# EasyEDA Pro project 25集创赛海云捷讯杯.epro, board PCB4_1
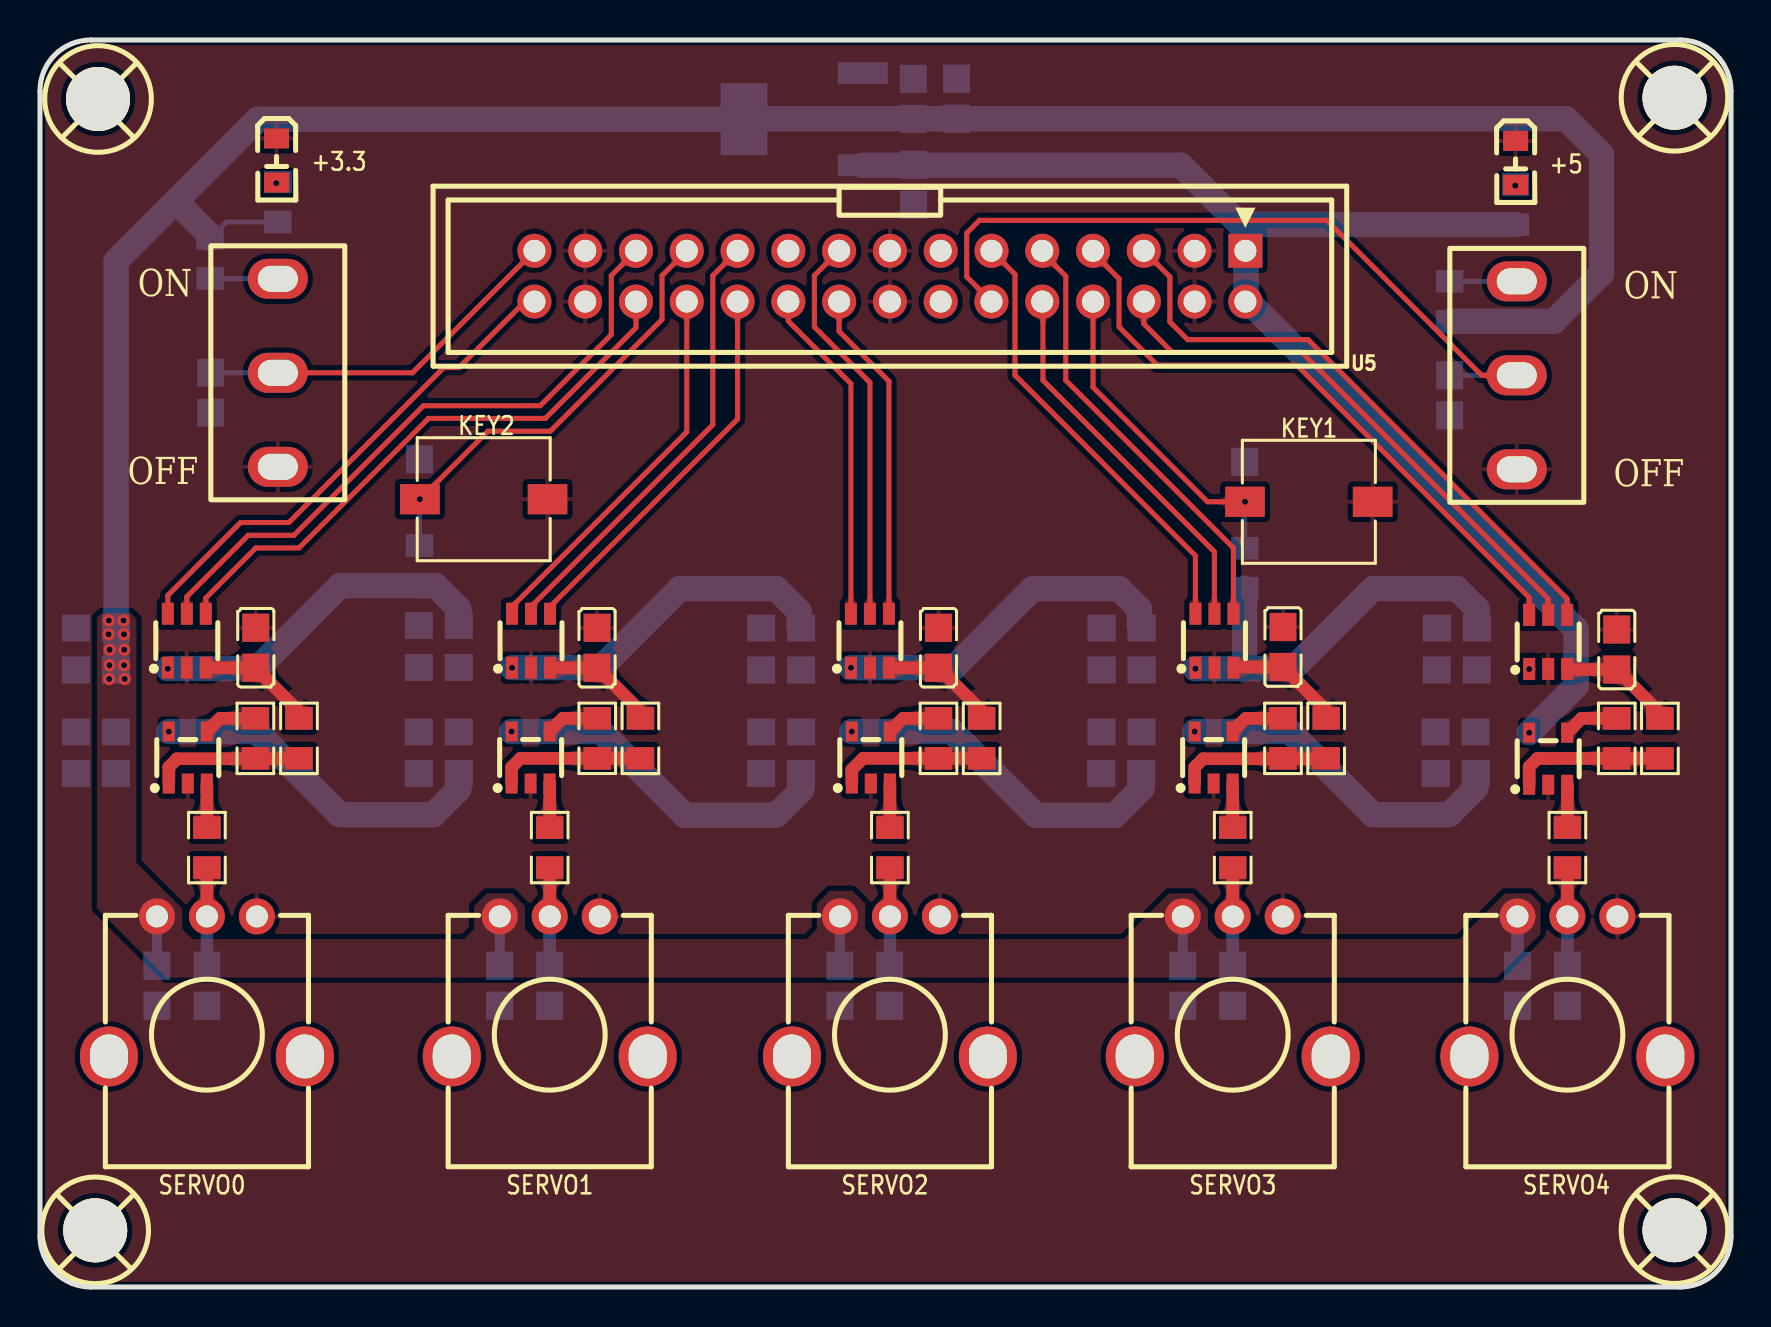
[diagram p16: board, top side]
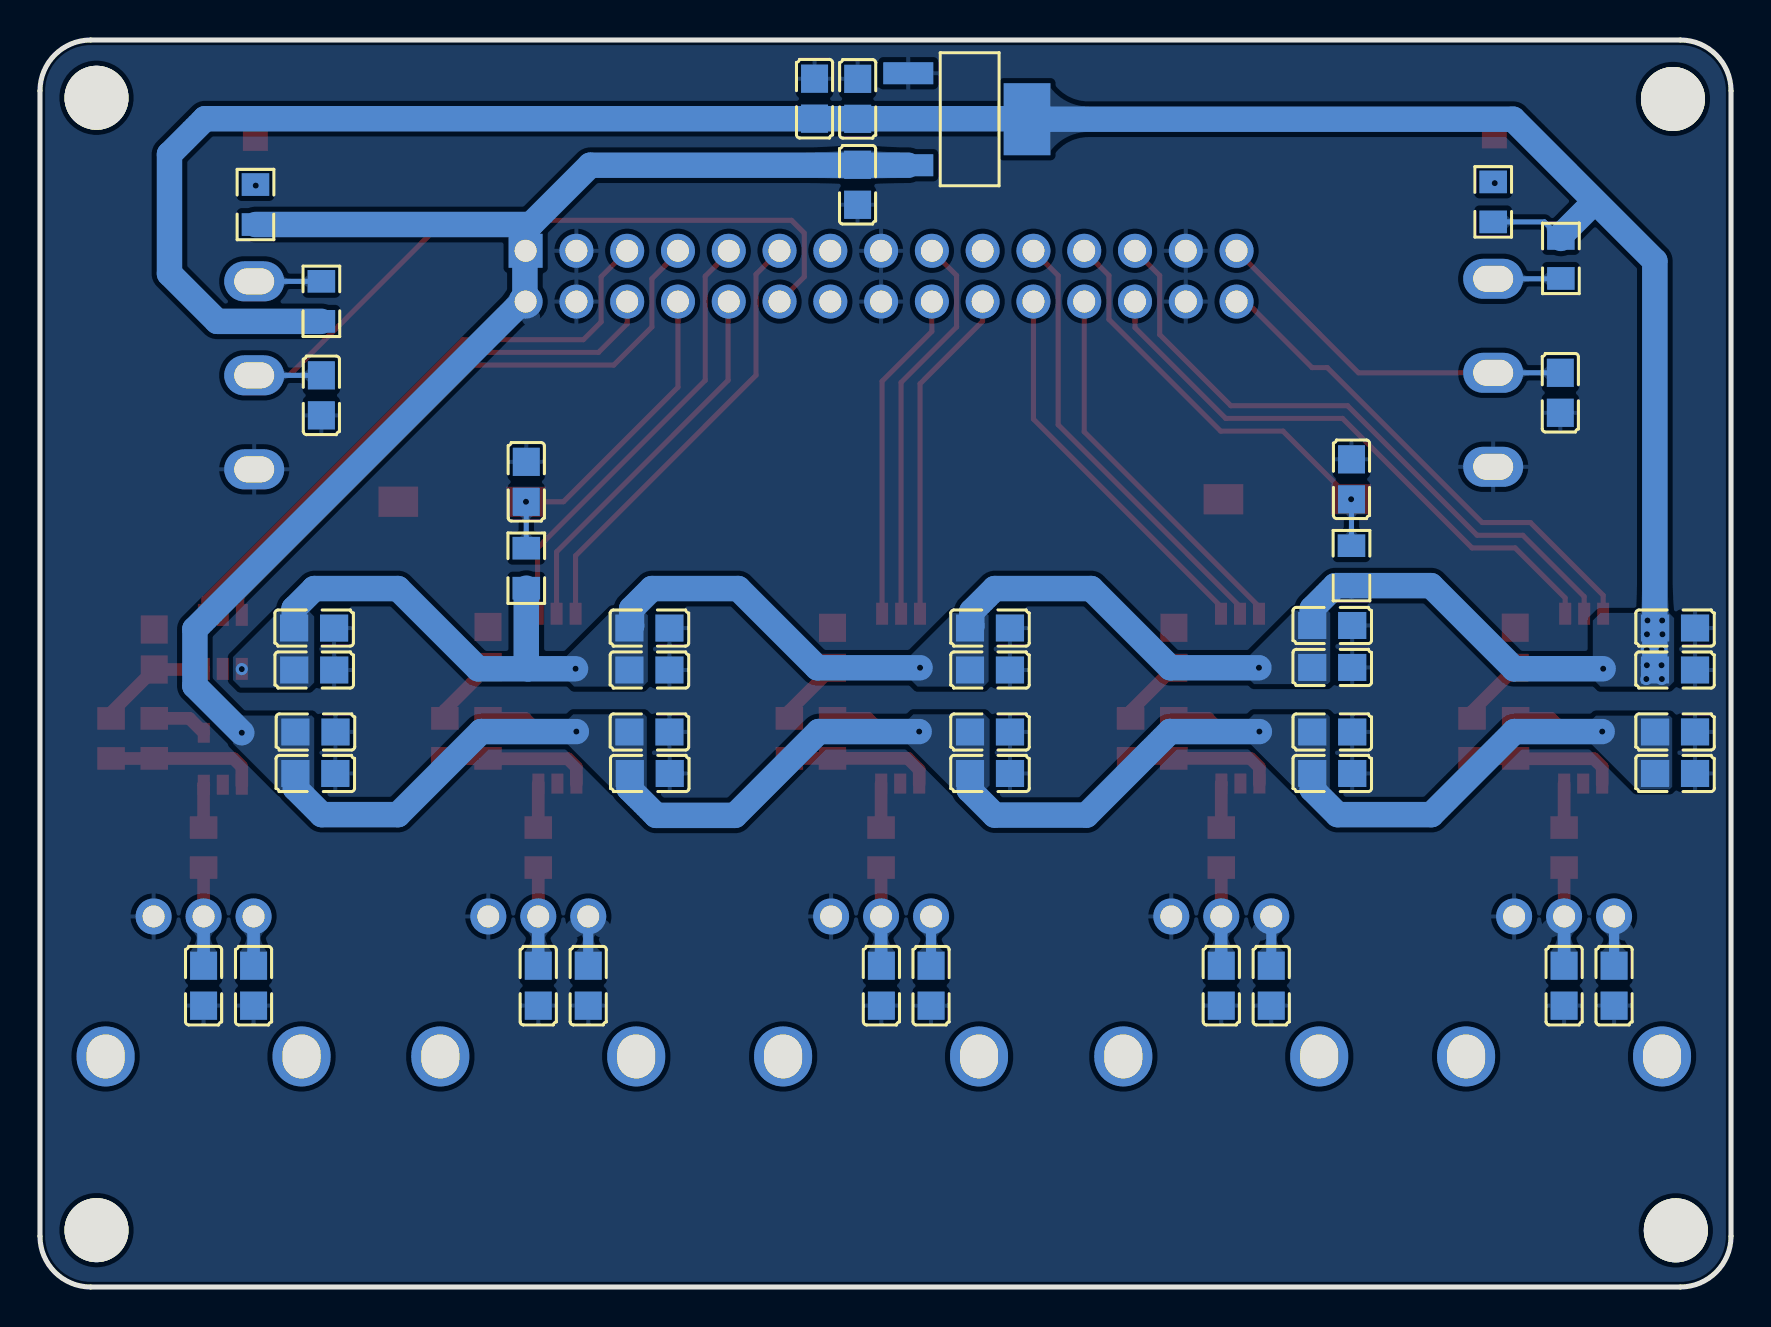
[diagram p17: board, bottom side, seen from below]

Outline 84.58 x 62.36 mm; copper layers: Top Layer, Bottom Layer. Coordinates in mm from the lower left corner of the outline.
Outline path: 0,59.82 0,2.54 arc(0.74,0.74) 2.54,0 82.04,0 arc(83.84,0.74) 84.58,2.54 84.58,59.82 arc(83.84,61.61) 82.04,62.36 2.54,62.36 arc(0.74,61.61) 0,59.82
Stack: Top Layer 0.035mm / Dielectric1 1.51mm FR4 er 4.5 / Bottom Layer 0.035mm

## Design rules (mm)
spacing copperThickness1oz (default): track to track 0.102, other pairs 0.152 to 0.3
spacing copperThickness2oz: track to track 0.203, other pairs 0.152 to 0.3
spacing Plane_innerPlane: track to track 0.102, other pairs 0.152 to 0.3
spacing Copper_copperRegion: track to track 0.102, other pairs 0.152 to 0.3
track width copperThickness1oz (default): min 0.127, default 0.254, max 2.54
track width copperThickness2oz: min 0.203, default 0.254, max 2.54
differential pair differentialPair (default): width min 0.127, default 0.254, max 2.54; gap min 0.152, default 0.152
pour e261 uses Copper_copperRegion
pour e419 uses Copper_copperRegion

## Placement (name value [footprint] x y rotation side)
C21  104  [c0805]  43.69 55.12 270 bottom
C22  10u  [c0805]  45.84 59.42 270 bottom
C23  104  [c0805]  43.68 59.41 270 bottom
C29  104  [c0805]  60.26 40.26 90 bottom
C30  104  [c0805]  18.98 40.39 90 bottom
C37  104  [c0805]  54.1 32.95 180 bottom
C38  106  [c0805]  54.1 30.85 180 bottom
C39  104  [c0805]  37.07 30.85 180 bottom
C40  106  [c0805]  37.07 32.95 180 bottom
C41  104  [c0805]  19.95 33.08 180 bottom
C42  106  [c0805]  19.95 30.98 180 bottom
C43  104  [c0805]  2.8 30.85 180 bottom
C44  106  [c0805]  2.8 32.95 180 bottom
C45  106  [c0805]  62.17 32 90 top
C46  106  [c0805]  44.94 31.96 90 top
C47  106  [c0805]  27.86 31.96 90 top
C48  106  [c0805]  10.8 31.97 90 top
C49  104  [C0805]  19.95 27.75 0 bottom
C50  106  [C0805]  19.95 25.68 0 bottom
C51  104  [C0805]  54.08 25.68 0 bottom
C52  106  [C0805]  54.1 27.75 0 bottom
C53  104  [C0805]  37.06 25.68 0 bottom
C54  106  [C0805]  37.07 27.75 0 bottom
C55  104  [C0805]  2.8 25.68 0 bottom
C56  106  [C0805]  2.8 27.76 0 bottom
C57  104  [c0805]  57.16 15.07 270 bottom
C58  104  [c0805]  59.66 15.07 90 bottom
C59  104  [c0805]  40.01 15.07 270 bottom
C60  104  [c0805]  42.5 15.07 90 bottom
C61  104  [c0805]  23 15.07 270 bottom
C62  104  [c0805]  25.5 15.07 90 bottom
C63  104  [c0805]  5.85 15.07 270 bottom
C64  104  [c0805]  8.35 15.07 90 bottom
C65  104  [c0805]  70.51 44.59 270 bottom
C66  104  [c0805]  8.54 44.72 270 bottom
C67  106  [c0805]  70.87 30.85 180 bottom
C68  104  [c0805]  70.87 32.95 180 bottom
C69  106  [c0805]  78.87 31.88 90 top
C70  104  [C0805]  70.81 25.68 0 bottom
C71  106  [C0805]  70.8 27.75 0 bottom
C72  104  [c0805]  73.9 15.07 270 bottom
C73  104  [c0805]  76.4 15.07 90 bottom
KEY1  TS665WS 250gf  [SW-SMD_L6.0-W6.0-LS6.6]  63.47 39.27 180 top
KEY2  TS665WS 250gf  [SW-SMD_L6.0-W6.0-LS6.6]  22.19 39.39 180 top
LED1  -  [LED_0805]  73.8 56.16 270 top
LED3  -  [LED_0805]  11.83 56.28 270 top
R7  10K  [R0805]  73.8 54.13 90 bottom
R9  10K  [R0805]  11.89 54.26 90 bottom
R11  10K  [R0805]  60.26 35.94 270 bottom
R12  10K  [R0805]  18.98 36.07 270 bottom
R28  500  [R0805]  59.66 21.97 90 top
R29  500  [R0805]  64.33 27.43 90 top
R30  500  [R0805]  62.17 27.43 270 top
R31  500  [R0805]  42.51 21.97 90 top
R32  500  [R0805]  47.1 27.43 90 top
R33  500  [R0805]  44.94 27.43 270 top
R34  500  [R0805]  25.5 21.97 90 top
R35  500  [R0805]  30.03 27.43 90 top
R36  500  [R0805]  27.87 27.44 270 top
R37  500  [R0805]  8.35 21.97 90 top
R38  500  [R0805]  12.95 27.43 90 top
R39  500  [R0805]  10.77 27.43 270 top
R40  10kΩ  [RES-ADJ-TH_RK09K1130AJ3]  59.66 15.03 180 top
R41  10kΩ  [RES-ADJ-TH_RK09K1130AJ3]  42.51 15.03 180 top
R42  10kΩ  [RES-ADJ-TH_RK09K1130AJ3]  25.5 15.03 180 top
R43  10kΩ  [RES-ADJ-TH_RK09K1130AJ3]  8.35 15.03 180 top
R44  10K  [R0805]  70.51 49.29 270 bottom
R45  10K  [R0805]  8.51 51.43 90 bottom
R46  500  [R0805]  76.4 21.97 90 top
R47  500  [R0805]  81.03 27.43 90 top
R48  500  [R0805]  78.87 27.43 270 top
R49  10kΩ  [RES-ADJ-TH_RK09K1130AJ3]  76.4 15.03 180 top
SCREW1  -  [M3螺丝]  2.97 59.34 0 top
SCREW2  -  [M3螺丝]  81.82 59.4 0 top
SCREW3  -  [M3螺丝]  2.83 2.77 0 top
SCREW4  -  [M3螺丝]  81.82 2.78 0 top
SW3  SS-12D10L5  [SW-TH_SS-12D10L5]  73.87 45.59 270 top
SW4  SS-12D10L5  [SW-TH_SS-12D10L5]  11.9 45.71 270 top
U1  ADC081S021CIMF/NOPB  [SOT-23-6_L2.9-W1.6-P0.95-LS2.8-BR]  58.74 32.32 270 top
U2  ADC081S021CIMF/NOPB  [SOT-23-6_L2.9-W1.6-P0.95-LS2.8-BR]  41.51 32.32 270 top
U3  ADC081S021CIMF/NOPB  [SOT-23-6_L2.9-W1.6-P0.95-LS2.8-BR]  24.56 32.32 270 top
U4  ADC081S021CIMF/NOPB  [SOT-23-6_L2.9-W1.6-P0.95-LS2.8-BR]  7.34 32.32 270 top
U5  XDFH-0254-2*15P  [CONN-TH_30P-P2.54_LX_XDFH-0254-2X15P]  42.51 50.55 180 top
U12  null  [ams1117]  38.18 58.39 0 bottom
U15  LMV721IDBVR  [SOT-23-5_L3.0-W1.7-P0.95-LS2.8-BR]  58.7 26.47 270 top
U16  LMV721IDBVR  [SOT-23-5_L3.0-W1.7-P0.95-LS2.8-BR]  41.56 26.47 270 top
U17  LMV721IDBVR  [SOT-23-5_L3.0-W1.7-P0.95-LS2.8-BR]  24.54 26.48 270 top
U18  LMV721IDBVR  [SOT-23-5_L3.0-W1.7-P0.95-LS2.8-BR]  7.39 26.47 270 top
U19  ADC081S021CIMF/NOPB  [SOT-23-6_L2.9-W1.6-P0.95-LS2.8-BR]  75.44 32.26 270 top
U20  LMV721IDBVR  [SOT-23-5_L3.0-W1.7-P0.95-LS2.8-BR]  75.44 26.42 270 top

## Footprints (pads in the part's own frame, mm; a bottom-side part is the same pattern mirrored in y, then rotated)
ams1117
  rect 2.5x1.1 smd: 1(2.97,-2.3) 2(2.97,0) 3(2.97,2.3)
  rect 2.34x3.6 smd: 4(-2.97,0)
c0805
  rect 1.41x1.35 smd: 1(-1,0) 2(1,0)
C0805
  rect 1.41x1.35 smd: 1(-1,0) 2(1,0)
CONN-TH_30P-P2.54_LX_XDFH-0254-2X15P
  rect 1.7x1.7 hole 1.1: 1(-17.78,-1.27)
  round 1.7 hole 1.1: 2(-17.78,1.27) 3(-15.24,-1.27) 4(-15.24,1.27) 5(-12.7,-1.27) 6(-12.7,1.27) 7(-10.16,-1.27) 8(-10.16,1.27) 9(-7.62,-1.27) 10(-7.62,1.27) 11(-5.08,-1.27) 12(-5.08,1.27) 13(-2.54,-1.27) 14(-2.54,1.27) 15(0,-1.27) 16(0,1.27) 17(2.54,-1.27) 18(2.54,1.27) 19(5.08,-1.27) 20(5.08,1.27) 21(7.62,-1.27) 22(7.62,1.27) 23(10.16,-1.27) 24(10.16,1.27) 25(12.7,-1.27) 26(12.7,1.27) 27(15.24,-1.27) 28(15.24,1.27) 29(17.78,-1.27) 30(17.78,1.27)
LED_0805
  rect 1x1.25 smd: 1(-1.15,0.005) 2(1.05,0.005)
M3螺丝
  round 3.2 hole 3.2: 1(-0.064,0.064)
R0805
  rect 1.133x1.377 smd: 1(-1,0) 2(1,0)
RES-ADJ-TH_RK09K1130AJ3
  round 1.8 hole 1.1: 1(-2.5,-3.5) 2(0,-3.5) 3(2.5,-3.5)
  oval 2.9x3 hole 1.9x2.2: 4(-4.9,3.5) 5(4.9,3.5)
SOT-23-5_L3.0-W1.7-P0.95-LS2.8-BR
  rect 1x0.6 smd: 1(1.3,-0.95) 2(1.3,0) 3(1.3,0.95) 4(-1.3,0.95) 5(-1.3,-0.95)
SOT-23-6_L2.9-W1.6-P0.95-LS2.8-BR
  rect 1.1x0.6 smd: 1(1.35,-0.95) 2(1.35,0) 3(1.35,0.95) 4(-1.35,0.95) 5(-1.35,0) 6(-1.35,-0.95)
SW-SMD_L6.0-W6.0-LS6.6
  rect 1.985x1.512 smd: 1(-3.192,0) 2(3.192,0)
SW-TH_SS-12D10L5
  oval 2x3 hole 1.3x2: 1(-4.7,0) 2(0,0) 3(4.7,0)

## Nets
+3.3V: C22.2 C23.2 C37.1 C38.1 C39.1 C40.1 C41.1 C42.1 C43.1 C44.1 C57.1 C59.1 C61.1 C63.1 C67.1 C68.1 C72.1 R9.1 R11.2 R12.2 R40.3 R41.3 R42.3 R43.3 R44.2 R45.2 R49.3 U1.1 U2.1 U3.1 U4.1 U12.2 U12.4 U19.1
+5V: C21.1 C49.2 C50.2 C51.2 C52.2 C53.2 C54.2 C55.2 C56.2 C70.2 C71.2 R7.1 U5.1 U5.2 U12.3 U15.5 U16.5 U17.5 U18.5 U20.5
GND: C21.2 C22.1 C23.1 C29.2 C30.2 C37.2 C38.2 C39.2 C40.2 C41.2 C42.2 C43.2 C44.2 C45.2 C46.2 C47.2 C48.2 C49.1 C50.1 C51.1 C52.1 C53.1 C54.1 C55.1 C56.1 C57.2 C58.1 C59.2 C60.1 C61.2 C62.1 C63.2 C64.1 C65.2 C66.2 C67.2 C68.2 C69.2 C70.1 C71.1 C72.2 C73.1 KEY1.1 KEY2.1 LED1.1 LED3.1 R40.1 R41.1 R42.1 R43.1 R49.1 SW3.3 SW4.3 U1.2 U2.2 U3.2 U4.2 U5.3 U5.4 U5.15 U5.16 U5.27 U5.28 U12.1 U15.2 U16.2 U17.2 U18.2 U19.2 U20.2
ADC_CS_0: U4.6 U5.30
ADC_CS_1: U3.6 U5.24
ADC_CS_2: U2.6 U5.20
ADC_CS_3: U1.6 U5.11
ADC_CS_4: U5.7 U19.6
ADC_DATA_0: U4.5 U5.25
ADC_DATA_1: U3.5 U5.21
ADC_DATA_2: U2.5 U5.17
ADC_DATA_3: U1.5 U5.10
ADC_DATA_4: U5.6 U19.5
ADC_IN_0: C48.1 R38.2 U4.3
ADC_IN_1: C47.1 R35.2 U3.3
ADC_IN_2: C46.1 R32.2 U2.3
ADC_IN_3: C45.1 R29.2 U1.3
ADC_IN_4: C69.1 R47.2 U19.3
ADC_SCLK_0: U4.4 U5.26
ADC_SCLK_1: U3.4 U5.22
ADC_SCLK_2: U2.4 U5.18
ADC_SCLK_3: U1.4 U5.9
ADC_SCLK_4: U5.5 U19.4
F14: C65.1 SW3.2 U5.12
G11: C29.1 KEY1.2 R11.1 U5.8
K9: C66.1 SW4.2 U5.29
K10: C30.1 KEY2.2 R12.1 U5.23
L12: U5.13
L14: U5.19
M12: U5.14
V_0: C64.2 R37.1 R43.2
V_1: C62.2 R34.1 R42.2
V_2: C60.2 R31.1 R41.2
V_3: C58.2 R28.1 R40.2
V_4: C73.2 R46.1 R49.2
$1N940: LED3.2 R9.2
$1N1188: R28.2 U15.3
$1N1191: R30.1 U15.4
$1N1192: R29.1 R30.2 U15.1
$1N1376: R31.2 U16.3
$1N1379: R33.1 U16.4
$1N1380: R32.1 R33.2 U16.1
$1N2110: R34.2 U17.3
$1N2113: R36.1 U17.4
$1N2114: R35.1 R36.2 U17.1
$1N2120: R37.2 U18.3
$1N2123: R39.1 U18.4
$1N2124: R38.1 R39.2 U18.1
$1N2571: LED1.2 R7.2
$1N6932: R44.1 SW3.1
$1N6937: R45.1 SW4.1
$1N11409: R46.2 U20.3
$1N11412: R47.1 R48.2 U20.1
$1N11414: R48.1 U20.4

Pads without a net: R40 4 5; R41 4 5; R42 4 5; R43 4 5; R49 4 5; SCREW1 1; SCREW2 1; SCREW3 1; SCREW4 1

## Via types
v1: diameter 0.61, hole 0.305, Top Layer to Bottom Layer, 24 vias

## Routing (per net, layer and track width the routed paths; a pad name or vN(x,y) marks a point on that pad's centre or on a via; arc(x,y) is an arc through that point)
+3.3V: length 204.9
  Bottom Layer w0.254: R45.2 9.34,53.26 R9.1
  Bottom Layer w0.508: C61.1 R42.3 ; C59.1 R41.3 ; C57.1 R40.3 ; C63.1 R43.3
  Bottom Layer w0.635: C72.1 R49.3
  Bottom Layer w1.27: C43.1 3.81,30.86 3.81,51.31 10.9,58.39 U12.4 35.24,58.42 C22.2 76.33,58.42 78.11,56.64 78.11,50.67 75.72,48.29 R44.2 ; C37.1 54.99,33.06 54.99,33.91 53.98,34.92 49.66,34.92 45.7,30.97 v1(40.56,30.97) ; 60.19,30.92 62.67,30.92 66.67,34.92 70.87,34.92 71.87,33.92 C68.1 ; 60.19,30.92 60.26,30.99 R11.2 ; 60.19,30.92 v1(57.79,30.92) ; 6.98,54.1 8.51,52.58 R45.2 ; v1(6.39,30.92) 10.85,30.92 15.01,35.07 R12.2 19.79,35.07 20.95,33.92 C41.1 ; C40.1 37.97,33.05 37.97,33.78 36.83,34.92 32,34.92 28.05,30.97 v1(23.61,30.97)
  vias: v1(3.44,33.33) v1(3.43,32.64) v1(3.48,31.87) v1(3.48,31.09) v1(3.46,30.4) v1(4.18,33.33) v1(4.2,32.64) v1(4.21,31.87) v1(4.21,31.09) v1(4.24,30.4) v1(74.49,30.9)
+5V: length 136.6
  Bottom Layer w1.27: 60.03,53.13 R7.1 ; 60.03,53.13 60.33,52.83 60.33,49.4 76.83,32.89 76.83,30.06 v1(74.49,27.72) ; 60.03,53.13 57.06,56.09 U12.3 ; v1(6.44,27.77) 10.83,27.77 14.99,23.62 19.68,23.62 20.95,24.89 C50.2 ; v1(57.75,27.77) 62.52,27.77 66.67,23.62 70.48,23.62 71.81,24.95 C70.2 ; 38.1,25.55 38.1,24.87 36.83,23.6 32.24,23.6 28.06,27.78 v1(23.59,27.78) ; 55.12,25.46 55.12,24.94 53.76,23.58 49.82,23.58 45.63,27.77 v1(40.61,27.77)
ADC_CS_0: length 25.9
  Top Layer w0.254: U4.6 6.39,34.59 10.03,38.23 12.45,38.23 20.19,45.97 20.95,45.97 24.26,49.28 U5.30 25.15,48.86
ADC_CS_1: length 19.2
  Top Layer w0.254: U5.24 32.35,42.77 23.61,34.03 23.61,33.67
ADC_CS_2: length 16.9
  Top Layer w0.254: U2.6 40.56,45.17 37.43,48.3 U5.20
ADC_CS_3: length 22.4
  Top Layer w0.254: U1.6 57.79,36.57 48.77,45.59 48.77,50.64 U5.11
ADC_CS_4: length 31.3
  Top Layer w0.254: U5.7 52.67,51.72 53.98,50.42 53.98,48.01 55.88,46.1 62.86,46.1 74.49,34.48 U19.6
ADC_DATA_0: length 32.2
  Top Layer w0.254: U5.25 28.58,50.58 28.58,47.62 25.02,44.07 19.18,44.07 12.7,37.59 10.41,37.59 7.34,34.52 U4.5
ADC_DATA_1: length 22.4
  Top Layer w0.254: U5.21 33.66,50.58 33.66,43.12 24.56,34.03 U3.5
ADC_DATA_2: length 19.8
  Top Layer w0.254: U5.17 38.73,50.58 38.73,48.01 41.51,45.23 U2.5
ADC_DATA_3: length 19.2
  Top Layer w0.254: U1.5 58.74,36.76 50.17,45.34 50.17,49.24 U5.10
ADC_DATA_4: length 27.8
  Top Layer w0.254: U5.6 55.21,48.17 56.64,46.74 63.11,46.74 75.44,34.41 U19.5
ADC_IN_0: length 5.9
  Top Layer w0.635: R38.2 12.95,28.78 10.8,30.94 C48.1 U4.3
ADC_IN_1: length 5.8
  Top Layer w0.635: 25.51,30.96 C47.1 30.03,28.8 R35.2
ADC_IN_2: length 5.9
  Top Layer w0.635: R32.2 47.1,28.81 C46.1 42.46,30.96
ADC_IN_3: length 6
  Top Layer w0.635: R29.2 64.33,28.84 C45.1 59.73,31 U1.3
ADC_IN_4: length 5.8
  Top Layer w0.635: U19.3 76.42,30.88 C69.1 81.03,28.72 R47.2
ADC_SCLK_0: length 29.2
  Top Layer w0.254: U4.4 8.29,34.46 10.8,36.96 12.95,36.96 19.43,43.43 25.27,43.43 29.81,47.97 U5.26
ADC_SCLK_1: length 19.5
  Top Layer w0.254: U3.4 25.51,34.02 34.89,43.4 U5.22
ADC_SCLK_2: length 16.6
  Top Layer w0.254: U2.4 42.46,45.29 39.97,47.79 U5.18
ADC_SCLK_3: length 22.1
  Top Layer w0.254: U5.9 50.13,51.72 51.31,50.55 51.31,45.34 59.69,36.95 U1.4
ADC_SCLK_4: length 30.5
  Top Layer w0.254: U19.4 76.39,34.41 63.43,47.37 57.4,47.37 56.52,48.26 56.52,50.51 U5.5
F14: length 38.3
  Top Layer w0.254: SW3.2 72.11,45.59 64.36,53.34 46.99,53.34 46.36,52.7 46.36,50.51 U5.12
  Bottom Layer w0.254: 70.52,45.59 SW3.2
G11: length 16.6
  Top Layer w0.254: v1(60.27,39.27) 58.4,39.27 52.67,44.99 U5.8
  Bottom Layer w0.254: R11.1 C29.1
K9: length 18.7
  Top Layer w0.254: U5.29 18.63,45.71 SW4.2
  Bottom Layer w0.254: C66.1 11.9,45.72
K10: length 22.1
  Top Layer w0.254: v1(19,39.39) 22.41,42.8 25.53,42.8 31.11,48.39 31.11,50.58 U5.23
  Bottom Layer w0.254: R12.1 C30.1
V_0: length 4.9
  Top Layer w0.635: R37.1 R43.2
  Bottom Layer w0.635: C64.2 8.35,18.53
V_1: length 4.9
  Top Layer w0.635: R42.2 R34.1
  Bottom Layer w0.635: C62.2 R42.2
V_2: length 4.9
  Top Layer w0.635: R41.2 42.51,20.97
  Bottom Layer w0.635: C60.2 42.51,16.08 R41.2
V_3: length 4.9
  Top Layer w0.635: 59.66,18.53 R28.1
  Bottom Layer w0.635: C58.2 R40.2
V_4: length 4.9
  Top Layer w0.635: R49.2 R46.1
  Bottom Layer w0.635: C73.2 R49.2
$1N940:
  vias: v1(11.82,55.2)
$1N1188: length 2.2
  Top Layer w0.635: R28.2 59.66,25.17
$1N1191: length 2.8
  Top Layer w0.635: R30.1 60.31,28.43 U15.4
$1N1192: length 7.6
  Top Layer w0.635: R29.1 64.31,26.42 58.18,26.42 57.75,25.99 U15.1
$1N1376: length 2.2
  Top Layer w0.635: R31.2 42.51,25.17
$1N1379: length 2.7
  Top Layer w0.635: U16.4 43.17,28.43 R33.1
$1N1380: length 7.4
  Top Layer w0.635: U16.1 40.61,25.87 41.17,26.43 R33.2 R32.1
$1N2110: length 2.2
  Top Layer w0.635: U17.3 25.5,25.17 R34.2
$1N2113: length 2.7
  Top Layer w0.635: U17.4 26.15,28.44 R36.1
$1N2114: length 7.4
  Top Layer w0.635: U17.1 23.59,25.99 24.03,26.43 R35.1
$1N2120: length 2.2
  Top Layer w0.635: R37.2 8.35,25.17
$1N2123: length 2.7
  Top Layer w0.635: R39.1 9,28.43 U18.4
$1N2124: length 7.5
  Top Layer w0.635: 12.93,26.43 12.91,26.42 6.86,26.42 6.44,26 U18.1
$1N2571:
  vias: v1(73.79,55.08)
$1N6932: length 3.4
  Bottom Layer w0.254: R44.1 SW3.1
$1N6937: length 3.4
  Bottom Layer w0.254: 8.54,50.41 11.9,50.41
$1N11409: length 2.1
  Top Layer w0.635: U20.3 76.4,25.1 R46.2
$1N11412: length 7.6
  Top Layer w0.635: U20.1 74.49,26.01 74.91,26.43 R47.1
$1N11414: length 2.8
  Top Layer w0.635: U20.4 77.11,28.43 R48.1

## Copper pours and planes (outline as drawn; the poured copper is in the pictures)
+3.3V on Top Layer: 57.16,17.91 59.44,17.91 59.44,16.76 57.16,16.76
+3.3V on Top Layer: 4.59,19.81 58.42,19.81 58.42,15.47 4.59,15.47
+3.3V on Top Layer: 2.85,33.71 7.11,33.71 7.11,16.88 2.85,16.88
+3.3V on Top Layer: 54.23,19.68 75.06,19.68 75.06,15.47 54.23,15.47
+3.3V on Bottom Layer: 70.87,33.78 74.93,33.78 74.93,29.97 70.87,29.97
+3.3V on Bottom Layer: 37.13,33.71 41.07,33.71 41.07,30.02 37.13,30.02
+3.3V on Bottom Layer: 20.05,33.83 24.11,33.83 24.11,30.15 20.05,30.15
+3.3V on Bottom Layer: 2.85,33.71 6.91,33.71 6.91,30.02 2.85,30.02
+3.3V on Bottom Layer: 54.18,33.83 58.24,33.83 58.24,30.02 54.18,30.02
+5V on Bottom Layer: 37.08,28.64 41.15,28.64 41.15,24.83 37.08,24.83
+5V on Bottom Layer: 20.07,28.64 24.13,28.64 24.13,24.83 20.07,24.83
+5V on Bottom Layer: 2.94,28.57 7.01,28.57 7.01,24.89 2.94,24.89
+5V on Bottom Layer: 70.87,28.57 74.93,28.57 74.93,24.76 70.87,24.76
+5V on Bottom Layer: 54.23,28.64 58.29,28.64 58.29,24.83 54.23,24.83
GND on Top Layer: -2.41,68.2 86.49,68.2 86.49,-2.03 -2.41,-2.03
GND on Bottom Layer: -4.19,64.39 91.19,64.39 91.19,-0.64 -4.19,-0.64

Small or netless copper shapes (teardrops, artwork), in the pictures only: 96 on Top Layer, 43 on Bottom Layer

## Text on the board
Top Silkscreen Layer: SERVO0 | +3.3 | KEY2 | SERVO1 | SERVO2 | SERVO3 | KEY1 | SERVO4 | +5 | OFF | ON
